# Altium project AD-timer-device.PrjPcb
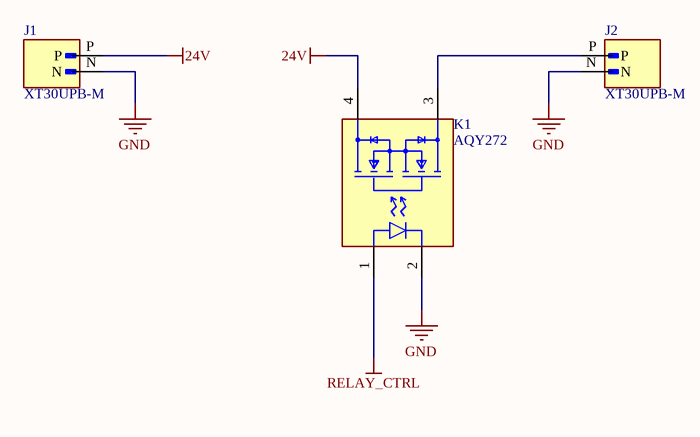
[diagram p0: Main.SchDoc]
4 sheets, 47 parts. Net scope: global (net labels, ports and power ports of the same name join across sheets).
Board file: PCB1.PcbDoc
Sheets:
  Main.SchDoc
  MCU.SchDoc
  DC-DC.SchDoc
  7segLED.SchDoc

## Sheet Main.SchDoc
size A4; SheetNumber: 1; SheetTotal: 4

### Parts
J1  XT30UPB-M  [AMASS_XT30UPB-M]
J2  XT30UPB-M  [AMASS_XT30UPB-M]
K1  AQY272  [FP-AQY272-MFG]

### Nets
24V: J1.P K1.4(2_DRAIN)
GND: J1.N J2.N K1.2(C)
RELAY_CTRL: K1.1(A)
NetJ2_P: J2.P K1.3(1_DRAIN)

### Library data of the parts
J1 J2 = XT30UPB-M: Socket; DC supply; XT30; male; PIN: 2; on PCBs; THT; yellow; 15A; 500V; MF: amass; SnapEDA_Link: https://www.snapeda.com/parts/XT30UPB-M/AMASS/view-part/?ref=snap; Package: None; Value: *; MP: XT30UPB-M; Check_prices: https://www.snapeda.com/parts/XT30UPB-M/AMASS/view-part/?ref=eda
K1 = CMP-05609-000164-1: SSR RELAY SPST-NO 2A 0-60V; Max Output Voltage: 60V; Test Voltage: 2.5kV; Forward Current: 50mA; Approvals: cULus; Capacitance: 1.5pF; On-State Resistance: 180mR; Throw Configuration: SPST; Contact Resistance: 110mR; Max Input Voltage: 1.5V; Relay Type: Relay; Min Operating Temperature: -40°C; Max Operating Temperature: 85°C; Output Current: 2A; RoHS Compliant: Yes; REACH SVHC: No SVHC; Radiation Hardening: No; Mount: Through Hole; Max Input Current: 50mA; Max Output Current: 2A; Isolation Voltage: 2.5kV; Packaging: Rail/Tube; Input Current: 50mA; Lead Free: Lead Free; Output Voltage: 60V; Number of Pins: 4; Package Quantity: 50; Case/Package: DIP; Current Rating: 2A; Voltage Rating (AC): 60V; Load Current: 2A; Termination: PC Pin

## Sheet MCU.SchDoc
size A4; SheetNumber: 2; SheetTotal: 4
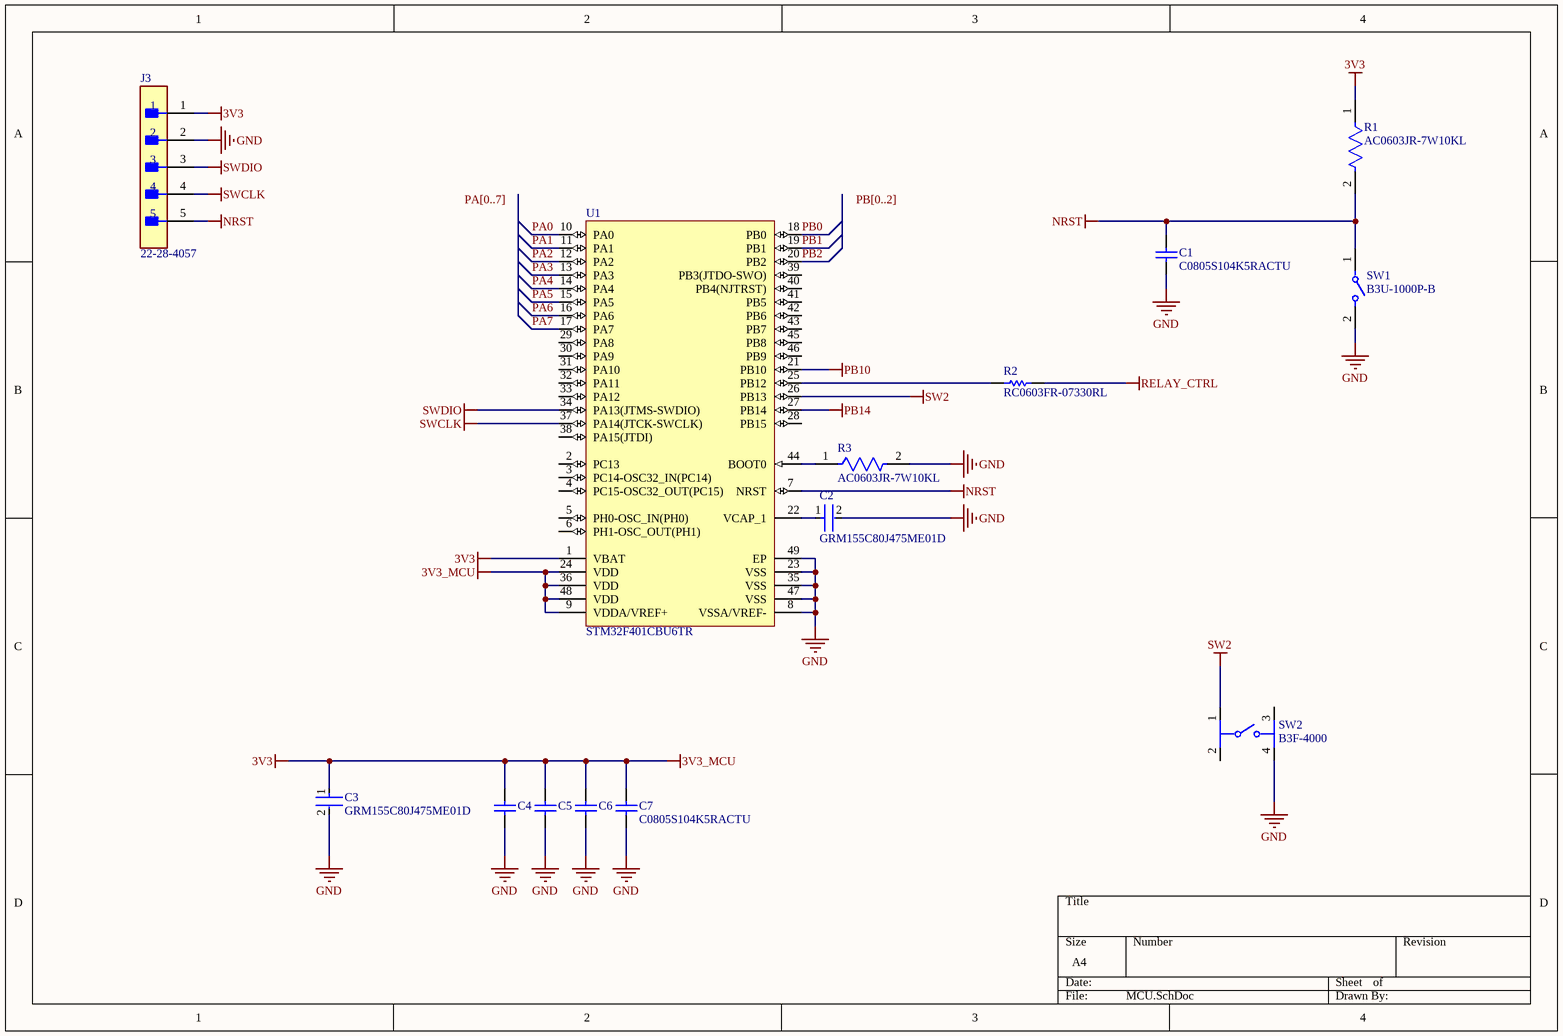
[diagram p1: MCU.SchDoc]

### Parts
C1  C0805S104K5RACTU  [CAPC2013X145X50NL20T25]
C2  GRM155C80J475ME01D  [FP-GRM155-0_2-MFG]
C3  GRM155C80J475ME01D  [FP-GRM155-0_2-MFG]
C4  C0805S104K5RACTU  [CAPC2013X145X50NL20T25]  (value not drawn)
C5  C0805S104K5RACTU  [CAPC2013X145X50NL20T25]  (value not drawn)
C6  C0805S104K5RACTU  [CAPC2013X145X50NL20T25]  (value not drawn)
C7  C0805S104K5RACTU  [CAPC2013X145X50NL20T25]
J3  22-28-4057  [FP-22-28-4057-MFG]
R1  AC0603JR-7W10KL  [FP-AC0603-IPC_A]
R2  RC0603FR-07330RL  [RESC1608X55X25NL10T15]
R3  AC0603JR-7W10KL  [FP-AC0603-IPC_A]
SW1  B3U-1000P-B  [FP-B3U-1000P-B-MFG]
SW2  B3F-4000  [FP-B3F-4000-MFG]
U1  STM32F401CBU6TR  [STM-UFQFPN48_L]

### Nets
3V3: C3.1 C4.2 C5.2 C6.2 C7.2 J3.1 R1.1 U1.1(VBAT) U1.9(VDDA/VREF+) U1.24(VDD) U1.36(VDD) U1.48(VDD)  [also labelled 3V3_MCU]
GND: C1.1 C2.2 C3.2 C4.1 C5.1 C6.1 C7.1 J3.2 R3.2 SW1.2 SW2.4 U1.8(VSSA/VREF-) U1.23(VSS) U1.35(VSS) U1.47(VSS) U1.49(EP)
NRST: C1.2 J3.5 R1.2 SW1.1 U1.7(NRST)
PB10: U1.21(PB10)
PB14: U1.27(PB14)
RELAY_CTRL: R2.2
SW2: SW2.1 U1.26(PB13)
SWCLK: J3.4 U1.37(PA14(JTCK-SWCLK))
SWDIO: J3.3 U1.34(PA13(JTMS-SWDIO))
PA0: U1.10(PA0)
PA1: U1.11(PA1)
PA2: U1.12(PA2)
PA3: U1.13(PA3)
PA4: U1.14(PA4)
PA5: U1.15(PA5)
PA6: U1.16(PA6)
PA7: U1.17(PA7)
PB0: U1.18(PB0)
PB1: U1.19(PB1)
PB2: U1.20(PB2)
NetC2_1: C2.1 U1.22(VCAP_1)
NetR2_1: R2.1 U1.25(PB12)
NetR3_1: R3.1 U1.44(BOOT0)

Not connected (* = marked no-connect by the designer): SW2 2 3; U1 2(PC13) 3(PC14-OSC32_IN(PC14)) 4(PC15-OSC32_OUT(PC15)) 5(PH0-OSC_IN(PH0)) 6(PH1-OSC_OUT(PH1)) 28(PB15) 29(PA8) 30(PA9) 31(PA10) 32(PA11) 33(PA12) 38(PA15(JTDI)) 39(PB3(JTDO-SWO)) 40(PB4(NJTRST)) 41(PB5) 42(PB6) 43(PB7) 45(PB8) 46(PB9)

### Buses and harness runs
bus PA[0..7]
bus PB[0..2]

### Notes on the sheet
- Labels drawn without touching a wire or pin: PA[0..7], PB[0..2]

### Library data of the parts
C1 C4-C7 = CMP-2007-01227-1: 100 nF 50 VDC X7R 10 % 0805; Manufacturer: Kemet; Part Number: C0805S104K5RACTU
C2 C3 = CMP-00260-151029462-1: 4.7 uF / GRM155C80J475ME01D; Voltage Rating (DC): 6.3V; Capacitance: 4.7µF; Dielectric: X6S; Length: 1mm; Case/Package: 0402; Width: 500µm; NexarPartId: 151029462; Thickness: 500µm
J3 = CMP-04776-001007-1: KK 100 HDR ASSY BKWY 05 CKT 30 S; Connector Type: Male Pin; Number of Contacts: 5; Glow Wire Compliant: Non-compliant; Gender: Male; Max Voltage Rating (DC): 250.25kV; Pitch: 2.54mm; Current Rating: 4A; Voltage Rating: 250V; Contact Resistance: 20mR; Min Operating Temperature: 0°C; Mount: Through Hole; Lead Free: Lead Free; Housing Color: Black; Max Operating Temperature: 75°C; Color: Black; Number of Rows: 1; Number of Circuits: 5; Contact Material: Brass; Packaging: Bulk; Contact Plating: Gold; Package Quantity: 1; Orientation: Straight; RoHS Compliant: Yes; Contact Type: Male Pin; Termination: Solder; Contact Mating Length: 0.32inch; Series: 42375; Number of Positions: 5; Housing Material: Thermoplastic
R1 R3 = CMP-03412-040683-1: RES 10kΩ 5.00% 0.2W 0603
R2 = CMP-1659-00020-2: Chip Resistor, 330 Ohm, +/- 1%, 0.1 W, -55 to 155 degC, 0603 (1608 Metric), RoHS, Tape and Reel; Tolerance: 10%; ESR: 800 mohm; Voltage Rating (DC): 16 V; Capacitance: 47 uF; Length: 7.3 mm; ComponentLink1URL: http://www.yageo.com/; Packaging: Tape and Reel; Pins: 2; ComponentLink1Description: Manufacturer URL; Case Code (Imperial): 2917; REACH SVHC: No SVHC; Width: 4.3 mm; ComponentLink2Description: Datasheet; Voltage Rating: 16 V; RoHSCompliant: True; Max Operating Temperature: 125degC; ComponentLink2URL: http://www.yageo.com/documents/recent/PYu-RC_Group_51_RoHS_L_04.pdf; Min Operating Temperature: -55degC; Case/Package: 2917; Radiation Hardening: No; DatasheetVersion: Rev. 4, 02/2016; Mount: Surface Mount; PackageReference: 0603; Package Quantity: 500; Case Code (Metric): 7343; PackageDescription: 2-Pin Surface Mount Device, Body 1.6 x 0.8 mm; Height: 3.1 mm
SW1 = CMP-08834-000005-1: SWITCH TACTILE SPST-NO 0.05A 12V; Manufacturer: Omron; Description: Tactile Switch SPST-NO Top Actuated Surface Mount; Operating Force: 1.5N; Contact Current Rating: 50mA; Contact Resistance: 100mΩ; Electromechanical Life: 200000Cycles; Height: 1.75mm; Device Class L2: Switches; Temperature Range High: +70°C; Digikey Description: SWITCH TACTILE SPST-NO 0.05A 12V; Throw Configuration: SPST-NO; Ambient Temperature Range High: +70°C; Temperature: -25°C to +70°C; Lead Free: Yes; ComponentLink2URL: https://omronfs.omron.com/en_US/ecb/products/pdf/en-b3u.pdf; Device Class L3: Tactile Switches; Manufacturer Part Number: B3U-1000P-B; Ambient Temperature Range Low: -25°C; Mount: Surface Mount; Automotive: No; Mouser Description: Tactile Switches Top Actuated with boss w/o ground; Octopart: https://octopart.com/b3u-1000p-b-omron-1057356; RoHS: TRUE; Package: 0; Device Class L1: Electromechanical; Voltage Rating Dc: 12V; Category: Switch; Temperature Range Low: -25°C; ComponentLink2Description: Datasheet
SW2 = CMP-08834-000001-1: SWITCH TACTILE SPST-NO 0.05A 24V; Manufacturer: Omron; Contact Current Rating: 50mA; Contact Resistance: 100mΩ; Operating Force: 1.27N; Electromechanical Life: 3000000Cycles; Digikey Description: SWITCH TACTILE SPST-NO 0.05A 24V; Automotive: No; Manufacturer Part Number: B3F-4000; Temperature Range High: +70°C; Octopart: https://octopart.com/b3f-4000-omron-22510; Mouser Description: Tactile Switches 12x12mm Std Ht 4.3 Gen Purpose 130g; Throw Configuration: SPST-NO; Height: 4.5mm; Voltage Rating Dc: 24V; Temperature: -25°C to +70°C; Device Class L1: Electromechanical; Device Class L2: Switches; Ambient Temperature Range Low: -25°C; Category: Switch; Mount: Through Hole; Device Class L3: Tactile Switches; RoHS: TRUE; ComponentLink2Description: Datasheet; Temperature Range Low: -25°C; Ambient Temperature Range High: +70°C; ComponentLink2URL: https://omronfs.omron.com/en_US/ecb/products/pdf/en-b3f.pdf; Package: B3F-4000; Lead Free: Yes
U1 = CMP-0243-00136-1: ARM Cortex-M4 32-bit MCU+FPU, 128 KB Flash, 64 KB Internal RAM, 36 I/Os, 48-Pin UFQFPN, -40 to 85 degC, Tape and Reel; Internal RAM Size (kB): 64; FLASH Size (Prog) (kB): 128; Operating Frequency(F) (Processor speed) (MHz): 84; I/Os (High Current): 36; Supply Voltage(Vcc) min (V): 1.7; Package Reference: 48-Pin Ultra Thin Fine Pitch Quad Flat No-Lead, 7 x 7 x 0.6 mm Body, 0.5 mm Pitch, Exposed Pad; Package Description: UFQFPN48; ComponentLink1Description: Manufacturer URL; ComponentLink2URL: http://www.st.com/st-web-ui/static/active/en/resource/technical/document/datasheet/DM00086815.pdf; ComponentLink2Description: Datasheet; ComponentLink1URL: http://www.st.com/; Mounting Technology: Surface Mount; Packing: Tape and Reel; Core: ARM Cortex-M4; DatasheetVersion: Rev. 5

## Sheet DC-DC.SchDoc
size A4; SheetNumber: 3; SheetTotal: 4
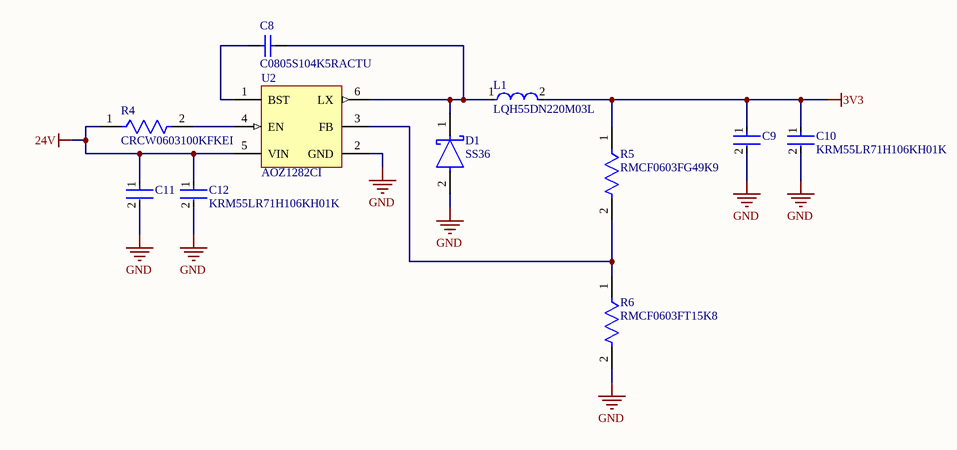
[diagram p2: DC-DC.SchDoc]

### Parts
C8  C0805S104K5RACTU  [CAPC2013X145X50NL20T25]
C9  KRM55LR71H106KH01K  [FP-KRM55L-6_1_5_3_3_1_2-C-MFG]  (value not drawn)
C10  KRM55LR71H106KH01K  [FP-KRM55L-6_1_5_3_3_1_2-C-MFG]
C11  KRM55LR71H106KH01K  [FP-KRM55L-6_1_5_3_3_1_2-C-MFG]  (value not drawn)
C12  KRM55LR71H106KH01K  [FP-KRM55L-6_1_5_3_3_1_2-C-MFG]
D1  SS36  [FP-403AG-MFG]
L1  LQH55DN220M03L  [FP-LQH55DN_03-MFG]
R4  CRCW0603100KFKEI  [FP-CRCW0603-e3-MFG]
R5  RMCF0603FG49K9  [FP-RMCF0603-MFG]
R6  RMCF0603FT15K8  [FP-RMCF0603-IPC_B]
U2  AOZ1282CI  [AO-SOT23-6L-6_V]

### Nets
3V3: C9.1 C10.1 L1.2 R5.1
24V: C11.1 C12.1 R4.1 U2.5(VIN)
GND: C9.2 C10.2 C11.2 C12.2 D1.2(A) R6.2 U2.2(GND)
NetC8_1: C8.1 U2.1(BST)
NetC8_2: C8.2 D1.1(C) L1.1 U2.6(LX)
NetR4_2: R4.2 U2.4(EN)
NetR5_2: R5.2 R6.1 U2.3(FB)

### Library data of the parts
C8 = CMP-2007-01227-1: as C1 on sheet MCU; Part Number: C0805S104K5RACTU
C9-C12 = CMP-06035-010592-1: Cap Ceramic Multilayer 10uF 50V ±10% 2220 Emboss T/R
D1 = CMP-07162-000004-1: DIODE SCHOTTKY 60V 3A SMC; Manufacturer: ON Semiconductor; Max Junction Temp: +150°C; Max Surge Forward Current: 100A; Standoff Height: 0.05mm; Peak Reverse Current: 0.5mA; Description: Diode Schottky 60V 3A Surface Mount SMC (DO-214AB); Manufacturer Part Number: SS36; Category: Diode; Device Class L2: Diodes; Lead Free: Yes; Mouser Description: In a Pack of 25, ON Semi 60V 3A, Schottky Diode, 2-Pin DO-214AB SS36; Automotive: No; Package: 403AG; Device Class L3: Schottky Diodes; Footprint Url: https://www.onsemi.com/pub/Collateral/403AG.PDF; Temperature: -55°C to +150°C; ComponentLink2URL: https://www.onsemi.com/pub/Collateral/SS39-D.PDF; Max Repetitive Reverse Voltage: 60V; Octopart: https://octopart.com/ss36-on+semiconductor-84331627; Temperature Range Low: -55°C; Forward Current: 3A; Device Class L1: Discrete Semiconductors; Digikey Description: DIODE SCHOTTKY 60V 3A SMC; RoHS: TRUE; Temperature Range High: +150°C; ComponentLink2Description: Datasheet; Height: 2.65mm
L1 = CMP-06042-011077-1: Wire Wound Ferrite Inductor for Power Lines 22μH ±20% 0.266Ω  1.2A 2220; Shielding: Unshielded; Inductance: 22uH; Test Frequency: 1MHz; DC Resistance (DCR): 190mR; Self Resonant Frequency: 15MHz; Current Rating: 1.2A; Length: 5.7mm; Military Standard: Not; Package Quantity: 350; Case/Package: 2220; Core Material: Ferrite; Radiation Hardening: No; DC Current: 1.2A; Tolerance: 20%; Inductance Tolerance: 20%; Height - Seated (Max): 0.198inch; Packaging: Tape and Reel; Weight: 0.016932oz; Termination: SMD/SMT; Lead Free: Lead Free; Width: 6mm; Case Code (Metric): 5750; Depth: 5.3mm; Resistor Type: Wirewound; Max Operating Temperature: 80°C; Max DC Current: 1.2A; Height: 4.7mm; Case Code (Imperial): 2220; REACH SVHC: No SVHC; Min Operating Temperature: -25°C; Mount: Surface Mount; Series Resistance: 190mR
R4 = CMP-02407-005189-1: RES Thick Film, 100kΩ, 1%, 0.1W, 100ppm/°C, 0603; Resistance: 100kR; Max Power Dissipation: 100mW; Number of Terminations: 2; Temperature Coefficient: 100ppm/°C; Composition: Thick Film; Max Operating Temperature: 155°C; Packaging: Tape and Reel; Lead Free: Lead Free; Min Operating Temperature: -55°C; Case/Package: 0603; Tolerance: 1%; Height: 0.02inch; Length: 0.061inch; Package Quantity: 5000; Width: 0.033inch; Features: Automotive AEC-Q200
R5 = CMP-26527-006070-1: 49.9kΩ ±1% 0.1W 0603 Thick Film Chip Resistor AEC-Q200 compliant; Resistance: 49.9kR; Temperature Coefficient: 100ppm/°C; Max Power Dissipation: 100mW; Max Operating Temperature: 155°C; Length: 0.061inch; Radiation Hardening: No; Tolerance: 1%; Mount: Surface Mount; Package Quantity: 10000; Number of Terminations: 2; Features: Automotive AEC-Q200; Width: 0.031inch; Packaging: Tape and Reel; Case Code (Metric): 1608; Case/Package: 0603; Series: RMCF; Resistor Type: Thick Film; Min Operating Temperature: -55°C; Height: 0.022inch; RoHS Compliant: Yes; Case Code (Imperial): 0603; Contact Plating: Tin
R6 = CMP-26527-006657-1: 15.8kΩ ±1% 0.1W 0603 Thick Film Chip Resistor AEC-Q200 compliant; Temperature Coefficient: 100ppm/°C; Resistance: 15.8kR; Max Power Dissipation: 100mW; Mount: Surface Mount; Packaging: Tape and Reel; Lead Free: Lead Free; Max Operating Temperature: 155°C; Min Operating Temperature: -55°C; Number of Terminations: 2; Case Code (Imperial): 0603; Radiation Hardening: No; Case Code (Metric): 1608; Length: 0.061inch; Features: Automotive AEC-Q200; Contact Plating: Tin; Series: RMCF; Height: 0.022inch; Resistor Type: Thick Film; Tolerance: 1%; RoHS Compliant: Yes; Case/Package: 0603; Width: 0.031inch
U2 = CMP-2000-05779-1: EZBuck(TM) 1.2 A Simple Buck Regulator, 4.5 to 36 V, -40 to 85 degC, 6-Pin SOT23-6L, RoHS, Tape and Reel; Manufacturer: Alpha and Omega; Synchronous Rectifier: No; Other Related Documents: AOSGreenPolicy; Voltage - Input (Max): 36V; Function: Step-Down; Number of Outputs: 1; Current - Output: 1.2A; Output Configuration: Positive; Voltage - Input (Min): 4.5V; Voltage - Output (Min/Fixed): 0.8V; Other Names: 785-1613-6; Frequency - Switching: 450kHz; Online Catalog: Buck(Step-Down)IC; Output Type: Adjustable; Mounting Type: SurfaceMount; Mounting Technology: SurfaceMount; Datasheet Version: Rev. 1.1, 06/2014; Voltage - Output (Max): 36V; Topology: Buck; Standard Package: 1; Manufacturer URL: http://www.aosmd.com/; Datasheet URL: https://datasheet.ciiva.com/15081/aoz1282ci-15081829.pdf; Series: EZBuck™; Package Reference: SOT23-6L; Family: PMIC-VoltageRegulators-DCDCSwitchingRegulators; Packaging: Digi-Reel®; Package / Case: SOT-23-6; Category: IntegratedCircuits(ICs); Supplier Device Package: SOT-23-6; Package Description: 6-Pin Small Outline Transistor, Body 1.6 x 2.9 mm, Pitch 0.95 mm; Operating Temperature: -40°C~85°C(TA)

## Sheet 7segLED.SchDoc
size A4; SheetNumber: 4; SheetTotal: 4
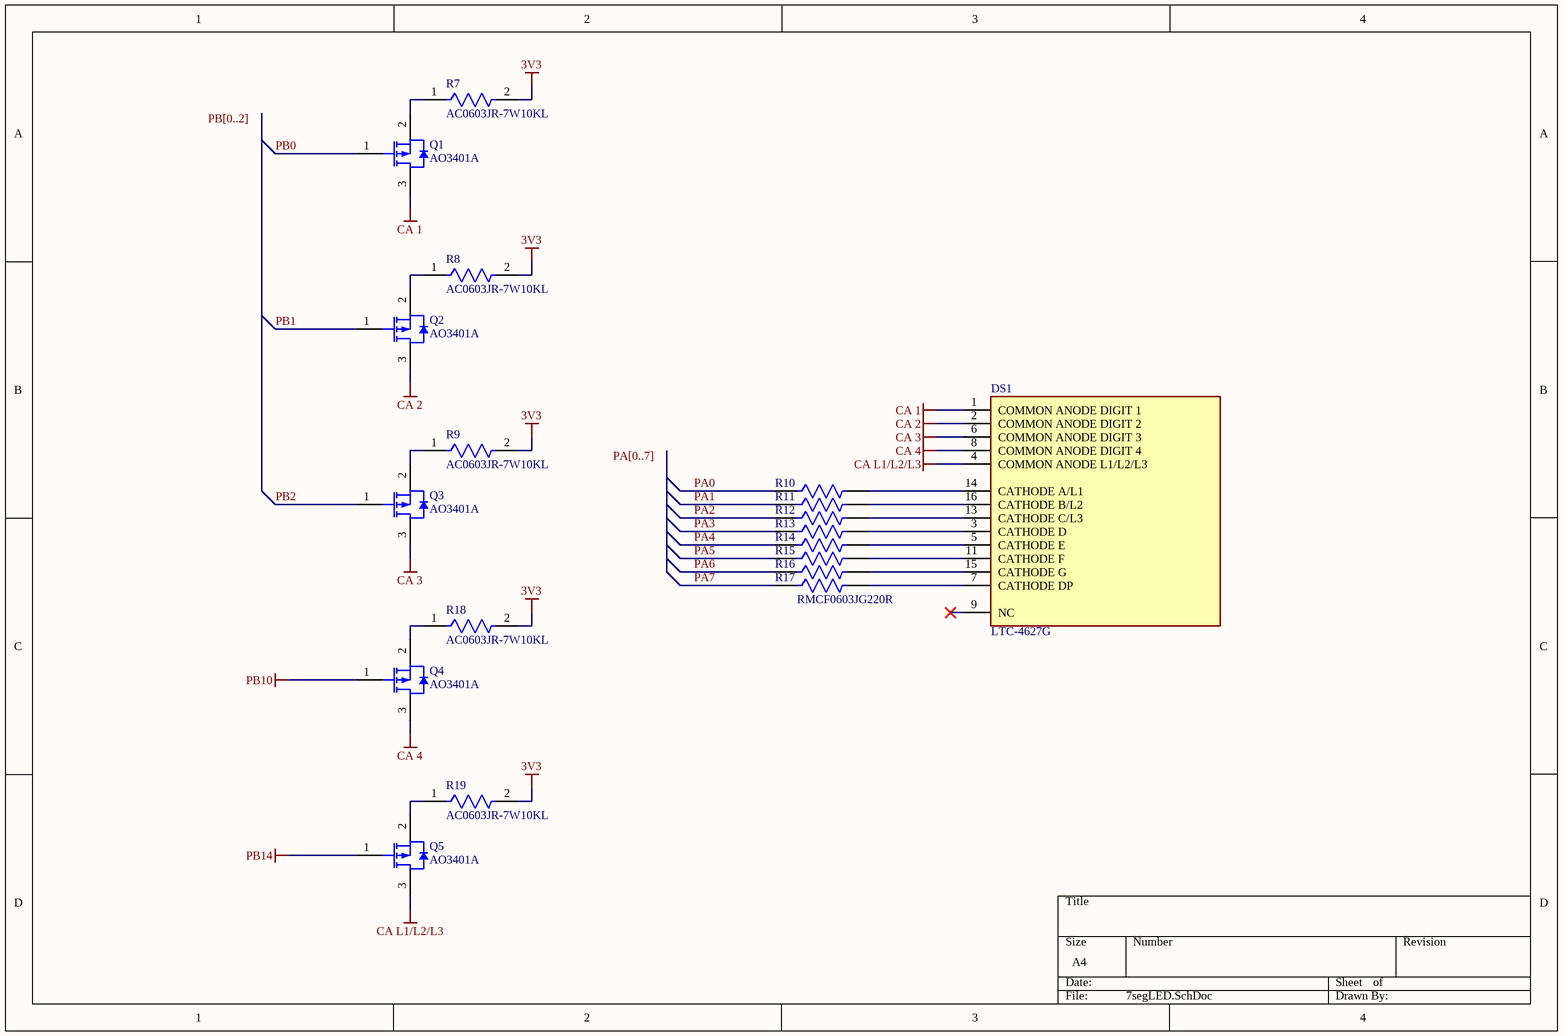
[diagram p3: 7segLED.SchDoc]

### Parts
DS1  LTC-4627G  [FP-LTC-4627G-MFG]
Q1  AO3401A  [AO-SOT-23-3L_V]
Q2  AO3401A  [AO-SOT-23-3L_V]
Q3  AO3401A  [AO-SOT-23-3L_V]
Q4  AO3401A  [AO-SOT-23-3L_V]
Q5  AO3401A  [AO-SOT-23-3L_V]
R7  AC0603JR-7W10KL  [FP-AC0603-IPC_A]
R8  AC0603JR-7W10KL  [FP-AC0603-IPC_A]
R9  AC0603JR-7W10KL  [FP-AC0603-IPC_A]
R10  RMCF0603JG220R  [FP-RMCF0603-MFG]  (value not drawn)
R11  RMCF0603JG220R  [FP-RMCF0603-MFG]  (value not drawn)
R12  RMCF0603JG220R  [FP-RMCF0603-MFG]  (value not drawn)
R13  RMCF0603JG220R  [FP-RMCF0603-MFG]  (value not drawn)
R14  RMCF0603JG220R  [FP-RMCF0603-MFG]  (value not drawn)
R15  RMCF0603JG220R  [FP-RMCF0603-MFG]  (value not drawn)
R16  RMCF0603JG220R  [FP-RMCF0603-MFG]  (value not drawn)
R17  RMCF0603JG220R  [FP-RMCF0603-MFG]
R18  AC0603JR-7W10KL  [FP-AC0603-IPC_A]
R19  AC0603JR-7W10KL  [FP-AC0603-IPC_A]

### Nets
3V3: R7.2 R8.2 R9.2 R18.2 R19.2
CA 1: DS1.1(COMMON_ANODE_DIGIT_1) Q1.3(DRAIN)
CA 2: DS1.2(COMMON_ANODE_DIGIT_2) Q2.3(DRAIN)
CA 3: DS1.6(COMMON_ANODE_DIGIT_3) Q3.3(DRAIN)
CA 4: DS1.8(COMMON_ANODE_DIGIT_4) Q4.3(DRAIN)
CA L1/L2/L3: DS1.4(COMMON_ANODE_L1/L2/L3) Q5.3(DRAIN)
PB10: Q4.1(GATE)
PB14: Q5.1(GATE)
PA0: R10.1
PA1: R11.1
PA2: R12.1
PA3: R13.1
PA4: R14.1
PA5: R15.1
PA6: R16.1
PA7: R17.1
PB0: Q1.1(GATE)
PB1: Q2.1(GATE)
PB2: Q3.1(GATE)
NetDS1_3: DS1.3(CATHODE_D) R13.2
NetDS1_5: DS1.5(CATHODE_E) R14.2
NetDS1_7: DS1.7(CATHODE_DP) R17.2
NetDS1_11: DS1.11(CATHODE_F) R15.2
NetDS1_13: DS1.13(CATHODE_C/L3) R12.2
NetDS1_14: DS1.14(CATHODE_A/L1) R10.2
NetDS1_15: DS1.15(CATHODE_G) R16.2
NetDS1_16: DS1.16(CATHODE_B/L2) R11.2
NetQ1_2: Q1.2(SOURCE) R7.1
NetQ2_2: Q2.2(SOURCE) R8.1
NetQ3_2: Q3.2(SOURCE) R9.1
NetQ4_2: Q4.2(SOURCE) R18.1
NetQ5_2: Q5.2(SOURCE) R19.1

Not connected (* = marked no-connect by the designer): DS1 9(NC)*

### Buses and harness runs
bus PA[0..7]
bus PB[0..2]

### Notes on the sheet
- Labels drawn without touching a wire or pin: PA[0..7], PB[0..2]

### Library data of the parts
DS1 = CMP-2000-06610-2: LED 7-SEG 4DIGIT GRN 0.4" CA; Manufacturer: Lite-On; Test Current: 20mA; Luminous Intensity: 2.2mcd; Wavelength: 569nm; Power Dissipation: 75mW; Element Config: Common Anode; Reverse Voltage: 5V; Forward Voltage: 2.1V; Temperature Range Low: -35°C; Lead Free: Yes; Manufacturer Part Number: LTC-4627G; Height: 7.25mm; Package: 0; Device Class L1: Optoelectronics; Category: Disp; Mouser Description: LED Displays & Accessories 4 Digit, Green; Display Type: LED; Forward Current: 20mA; Device Class L2: Displays; Device Class L3: LED Displays; ComponentLink2Description: Datasheet; Octopart: https://octopart.com/ltc-4627g-lite-on-8442722; ComponentLink2URL: https://datasheet.ciiva.com/15136/getdatasheetpartid-630597-15136600.pdf; Automotive: No; Temperature: -35°C to +85°C; RoHS: TRUE; Temperature Range High: +85°C; Digikey Description: LED 7-SEG 4DIGIT GRN 0.4" CA
Q1-Q5 = CMP-2000-05778-1: P-Channel MOSFET, 30 V, 4 A, -55 to 150 degC, 3-Pin SOT-23-3L, RoHS, Tape and Reel; Manufacturer: Alpha and Omega; Output Power (Max): NotRequiredW; Power Dissipation: 1.4W; Rad Hardened: No; Drain Efficiency: NotRequired%; Drain-Source On-Volt: 30V; Noise Figure: NotRequireddB; Frequency (Max): NotRequiredMHz; Number of  Elements: 1; Gate-Source Voltage (Max): ?12V; Drain Current (Max): 4A; Channel Mode: Enhancement; Drain-Source On-Res: 0.044ohm; Type: PowerMOSFET; Polarity: P; Package URL: http://www.aosmd.com/res/packaging_information/SOT-23-3L.pdf; Datasheet URL: http://www.aosmd.com/res/data_sheets/AO3401A.pdf; Package Type: SOT-23; Package Description: 3-Pin Small Outline Transistor, Body 2.95 x 1.6 mm, Pitch 0.95 mm; Mounting: SurfaceMount; Manufacturer URL: http://www.aosmd.com/; Continuous Drain Current: 4A; Package Reference: SOT-23-3L; Mounting Technology: SurfaceMount; Operating Temperature Classification: Military; Power Gain: NotRequireddB; Datasheet Version: Rev. 3, 03/2011; Operating Temp Range: -55Cto150C; Pin Count: 3
R7-R9 R18 R19 = CMP-03412-040683-1: RES 10kΩ 5.00% 0.2W 0603
R10-R17 = CMP-26527-002055-1: 220Ω ±5% 0.1W 0603 Thick Film Chip Resistor AEC-Q200 compliant; Resistance: 220R; Temperature Coefficient: 100ppm/°C; Min Operating Temperature: -55°C; Contact Plating: Tin; Max Operating Temperature: 155°C; Radiation Hardening: No; Tolerance: 5%; RoHS Compliant: Yes; Packaging: Tape and Reel; Mount: Surface Mount; Case/Package: 0603; Resistor Type: Thick Film

## Nets that join several sheets
3V3: MCU (12 pins), DC-DC (C9.1 C10.1 L1.2 R5.1), 7segLED (5 pins)
24V: Main (J1.P K1.4), DC-DC (C11.1 C12.1 R4.1 U2.5)
GND: Main (J1.N J2.N K1.2), MCU (16 pins), DC-DC (7 pins)
PB10: MCU (U1.21), 7segLED (Q4.1)
PB14: MCU (U1.27), 7segLED (Q5.1)
RELAY_CTRL: Main (K1.1), MCU (R2.2)
PA0: MCU (U1.10), 7segLED (R10.1)
PA1: MCU (U1.11), 7segLED (R11.1)
PA2: MCU (U1.12), 7segLED (R12.1)
PA3: MCU (U1.13), 7segLED (R13.1)
PA4: MCU (U1.14), 7segLED (R14.1)
PA5: MCU (U1.15), 7segLED (R15.1)
PA6: MCU (U1.16), 7segLED (R16.1)
PA7: MCU (U1.17), 7segLED (R17.1)
PB0: MCU (U1.18), 7segLED (Q1.1)
PB1: MCU (U1.19), 7segLED (Q2.1)
PB2: MCU (U1.20), 7segLED (Q3.1)